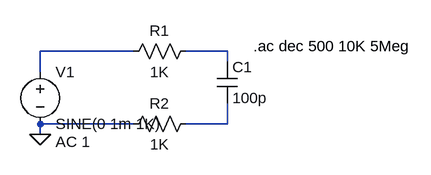
[diagram p0: schematic Draft3.asc]
Draft3.asc, the LTspice schematic file:
Version 4.1
SHEET 1 880 680
WIRE 112 96 -32 96
WIRE 256 96 192 96
WIRE 256 112 256 96
WIRE -32 128 -32 96
WIRE 112 208 -32 208
WIRE 256 208 256 176
WIRE 256 208 192 208
WIRE -32 224 -32 208
FLAG -32 224 0
SYMBOL res 208 80 R90
WINDOW 0 0 56 VBottom 2
WINDOW 3 32 56 VTop 2
SYMATTR InstName R1
SYMATTR Value 1K
SYMBOL res 208 192 R90
WINDOW 0 0 56 VBottom 2
WINDOW 3 32 56 VTop 2
SYMATTR InstName R2
SYMATTR Value 1K
SYMBOL cap 240 112 R0
SYMATTR InstName C1
SYMATTR Value 100p
SYMBOL voltage -32 112 R0
WINDOW 123 24 124 Left 2
WINDOW 39 0 0 Left 0
SYMATTR InstName V1
SYMATTR Value SINE(0 1m 1K)
SYMATTR Value2 AC 1
TEXT 296 88 Left 2 !.ac dec 500 10K 5Meg

The netlist it stands for:
* Draft3.asc
R1 N002 N001 1K
R2 N003 0 1K
C1 N002 N003 100p
V1 N001 0 SINE(0 1m 1K) AC 1
.ac dec 500 10K 5Meg
.backanno
.end